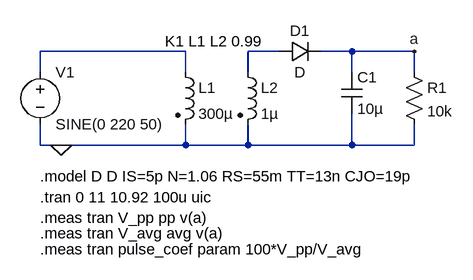
[diagram p0: schematic 1.2.asc]
1.2.asc, the LTspice schematic file:
Version 4
SHEET 1 880 680
WIRE 320 80 96 80
WIRE 464 80 416 80
WIRE 576 80 528 80
WIRE 672 80 576 80
WIRE 96 112 96 80
WIRE 320 112 320 80
WIRE 416 112 416 80
WIRE 576 112 576 80
WIRE 672 112 672 80
WIRE 96 224 96 192
WIRE 128 224 96 224
WIRE 320 224 320 192
WIRE 320 224 128 224
WIRE 416 224 416 192
WIRE 416 224 320 224
WIRE 576 224 576 176
WIRE 576 224 416 224
WIRE 672 224 672 192
WIRE 672 224 576 224
FLAG 128 224 0
FLAG 672 80 a
SYMBOL voltage 96 96 R0
WINDOW 123 0 0 Left 0
WINDOW 39 0 0 Left 0
SYMATTR InstName V1
SYMATTR Value SINE(0 220 50)
SYMBOL ind2 304 96 R0
SYMATTR InstName L1
SYMATTR Value 300µ
SYMATTR SpiceLine Rser=10m
SYMATTR Type ind
SYMBOL ind2 400 96 R0
SYMATTR InstName L2
SYMATTR Value 1µ
SYMATTR SpiceLine Rser=10m
SYMATTR Type ind
SYMBOL diode 464 96 R270
WINDOW 0 32 32 VTop 2
WINDOW 3 0 32 VBottom 2
SYMATTR InstName D1
SYMBOL cap 560 112 R0
SYMATTR InstName C1
SYMATTR Value 10µ
SYMBOL res 656 96 R0
SYMATTR InstName R1
SYMATTR Value 10k
TEXT 96 272 Left 2 !.model D D IS=5p N=1.06 RS=55m TT=13n CJO=19p
TEXT 96 304 Left 2 !.tran 0 11 10.92 100u uic
TEXT 96 336 Left 2 !.meas tran V_pp pp v(a)
TEXT 96 360 Left 2 !.meas tran V_avg avg v(a)
TEXT 96 384 Left 2 !.meas tran pulse_coef param 100*V_pp/V_avg
TEXT 288 64 Left 2 !K1 L1 L2 0.99

The netlist it stands for:
* 1.2.asc
V1 N001 0 SINE(0 220 50)
L1 N001 0 300µ Rser=10m
L2 N002 0 1µ Rser=10m
D1 N002 a D
C1 a 0 10µ
R1 a 0 10k
.model D D
.lib standard.dio
.model D D IS=5p N=1.06 RS=55m TT=13n CJO=19p
.tran 0 11 10.92 100u uic
.meas tran V_pp pp v(a)
.meas tran V_avg avg v(a)
.meas tran pulse_coef param 100*V_pp/V_avg
K1 L1 L2 0.99
.backanno
.end

* Results of the author's LTspice run, read from the files saved beside the schematic
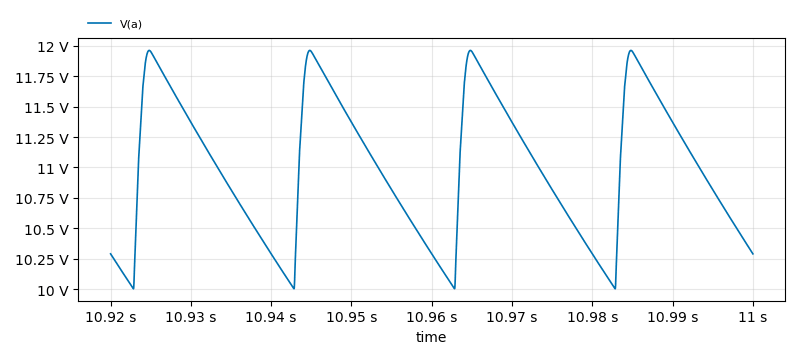
[diagram p1: Transient Analysis of 1.2.asc, plotted from the saved traces]
* Transient Analysis, 1 run:
*   V(a): min 10 V, max 11.96 V, average 10.99 V, rms 11.01 V, last 10.29 V
* From the log:
*   v_pp: PP(v(a))=1.96046 FROM 0 TO 0.08
*   v_avg: AVG(v(a))=10.9928 FROM 0 TO 0.08
*   pulse_coef: 100*v_pp/v_avg=17.834